# Altium schematic sheet Main.schdoc
size 304 x 211 mm
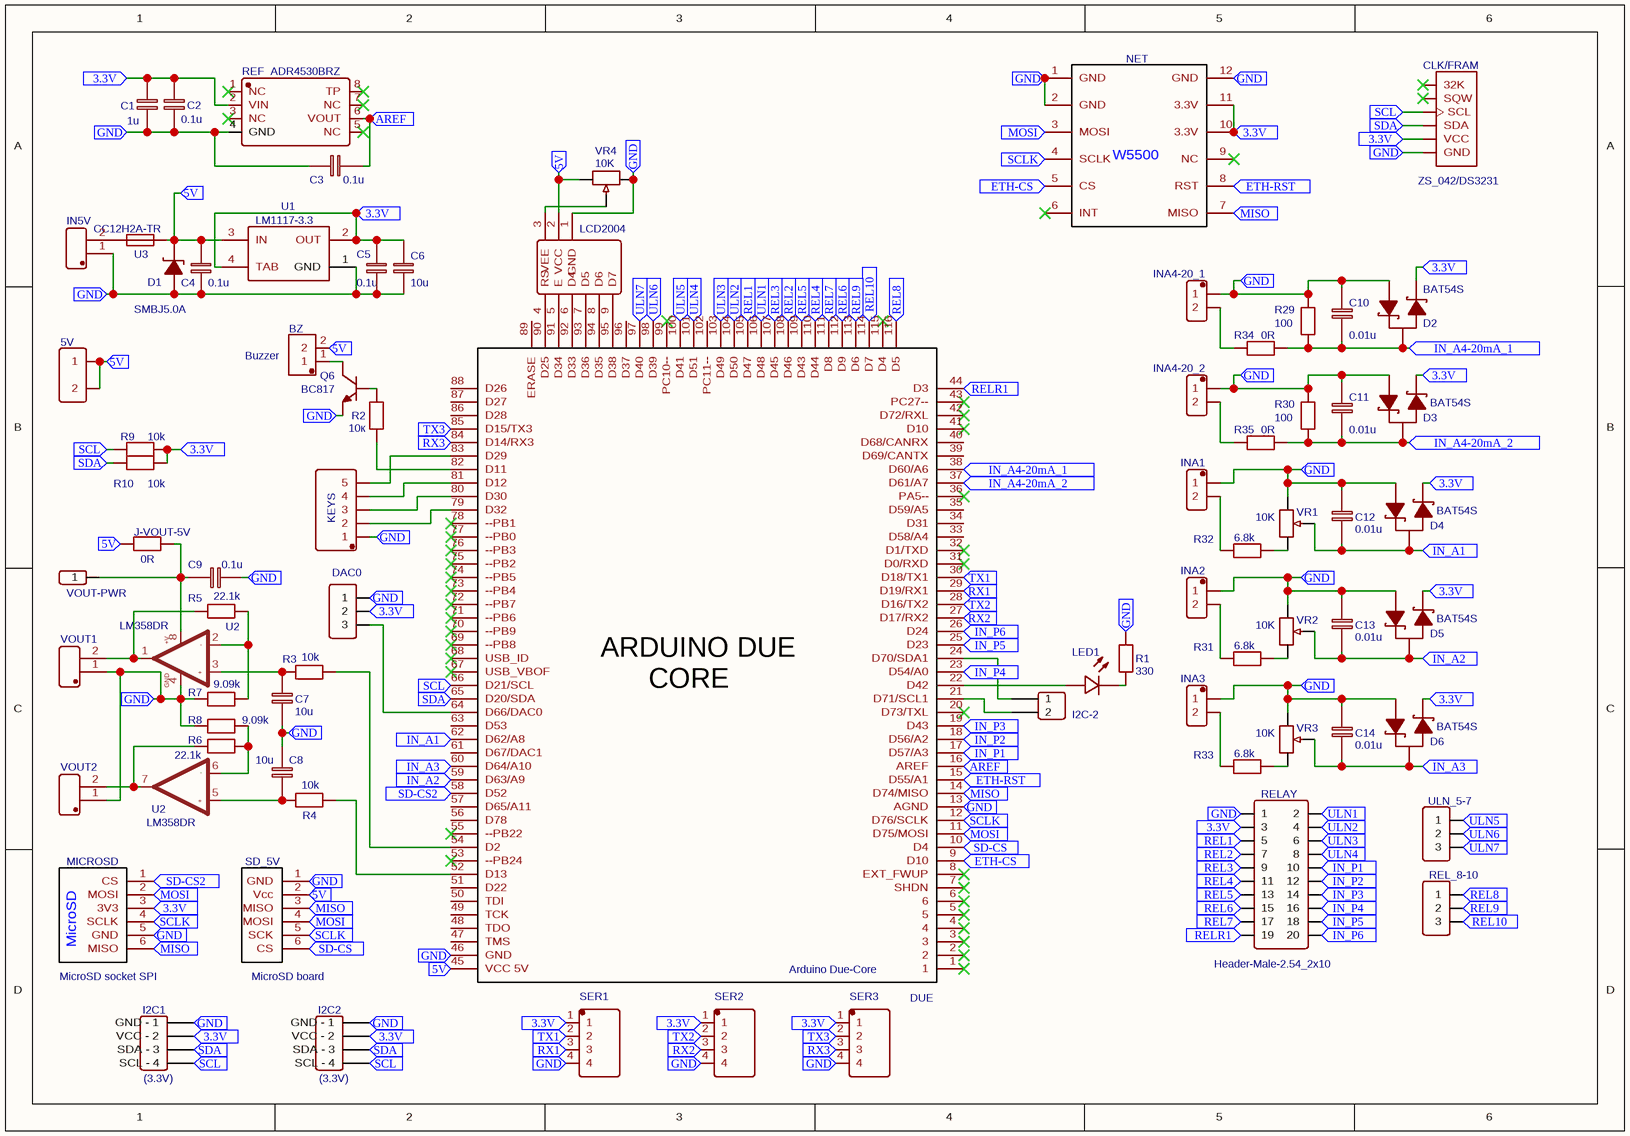
[diagram p0: Main.schdoc]

## Parts
(Parts that share a designator on the sheet are numbered #1, #2 ... from top to bottom, then left to right.)
5V  Header-Male-2.54_1x2  [HDR-2X1/2.54]  (value not drawn)
BZ  Buzzer  [KF350-3.5MM-2P]
C1  1u  [0805]
C2  0.1u  [0805]
C3  0.1u  [0805]
C4  0.1u  [0805]
C5  0.1u  [0805]
C6  10u  [0805]
C7  10u  [1206]
C8  10u  [1206]
C9  0.1u  [0805]
C10  0.01u  [0805]
C11  0.01u  [0805]
C12  0.01u  [0805]
C13  0.01u  [0805]
C14  0.01u  [0805]
CLK/FRAM  ZS_042/DS3231  [ZS-042]
D1  SMBJ5.0A  [SMB/DO-214AA]
D2  BAT54S  [SOT-23(SOT-23-3)]
D3  BAT54S  [SOT-23(SOT-23-3)]
D4  BAT54S  [SOT-23(SOT-23-3)]
D5  BAT54S  [SOT-23(SOT-23-3)]
D6  BAT54S  [SOT-23(SOT-23-3)]
DAC0  Header-Male-2.54_1x3  [HDR-3X1/2.54]  (value not drawn)
DUE  Arduino Due-Core  [ARDUINO DUE CORE]
I2C1  (3.3V)  [HDR-4X1/2.54 I2C BOARD]
I2C2  (3.3V)  [HDR-4X1/2.54 I2C BOARD]
I2C-2  2.54mm 1*2P  [HDR-2X1/2.54]  (value not drawn)
IN5V  KF128_2P_5.08  [KF128_2P_5.08]  (value not drawn)
INA1  KF301-2P  [KF128_2P_5.08]  (value not drawn)
INA2  KF301-2P  [KF128_2P_5.08]  (value not drawn)
INA3  KF301-2P  [KF128_2P_5.08]  (value not drawn)
INA4-20_1  KF301-2P  [KF128_2P_5.08]  (value not drawn)
INA4-20_2  KF301-2P  [KF128_2P_5.08]  (value not drawn)
J-VOUT-5V  0R  [0805]
KEYS  Header-Male-2.54_1x5  [DIP-1X5P-2.54MM-M]  (value not drawn)
LCD2004  LCD 1602, 2004. 4-bit mode (HD44780) pin-header  [HDR-16X1/2.54 - LCD1602, LCD2004]  (value not drawn)
LED1  LED GREEN  [LED-1206F]  (value not drawn)
MICROSD  MicroSD socket SPI  [MICROSD SOCKET]
NET  W5500 module  [W5500_MODULE]  (value not drawn)
Q6  BC817  [SOT-23(SOT-23-3)]
R1  330  [0805]
R2  10к  [0805]
R3  10k  [0805]
R4  10k  [0805]
R5  22.1k  [0805]
R6  22.1k  [0805]
R7  9.09k  [0805]
R8  9.09k  [0805]
R9  10k  [0805]
R10  10k  [0805]
R29  100  [1206]
R30  100  [1206]
R31  6.8k  [0805]
R32  6.8k  [0805]
R33  6.8k  [0805]
R34  0R  [1206]
R35  0R  [1206]
REF  ADR4530BRZ  [SOIC-8_150MIL]
REL_8-10  Header-Male-2.54_1x3  [HDR-3X1/2.54]  (value not drawn)
RELAY  Header-Male-2.54_2x10  [HDR-10X2/2.54]
SD_5V  MicroSD board  [MICROSD CARD ADAPTER]
SER1  Serail1  [DIP-1X4P-2.54MM RS485-UART]  (value not drawn)
SER2  Serail1  [DIP-1X4P-2.54MM RS485-UART]  (value not drawn)
SER3  Serail1  [DIP-1X4P-2.54MM RS485-UART]  (value not drawn)
U1  LM1117-3.3  [SOT-223]
U2#1  LM358DR  [SOIC-8_150MIL]
U2#2  LM358DR  [SOIC-8_150MIL]
U3  CC12H2A-TR  [FUSE-CC12H]
ULN_5-7  Header-Male-2.54_1x3  [HDR-3X1/2.54]  (value not drawn)
VOUT1  KF128_2P_5.08  [KF128_2P_5.08]  (value not drawn)
VOUT2  KF128_2P_5.08  [KF128_2P_5.08]  (value not drawn)
VOUT-PWR  Header-Male-2.54_1x1  [HDR-1X1/2.54]  (value not drawn)
VR1  10K  [RES-ADJ-SMD_3PIN-V-L3.1-W3.8-H1.62-PITCH1.0]
VR2  10K  [RES-ADJ-SMD_3PIN-V-L3.1-W3.8-H1.62-PITCH1.0]
VR3  10K  [RES-ADJ-SMD_3PIN-V-L3.1-W3.8-H1.62-PITCH1.0]
VR4  10K  [RES-ADJ-SMD_3PIN-V-L3.1-W3.8-H1.62-PITCH1.0]

## Ports
3.3V, 5V, AREF, ETH-CS, ETH-RST, GND, IN_A1, IN_A2, IN_A3, IN_A4-20mA_1, IN_A4-20mA_2, IN_P1, IN_P2, IN_P3, IN_P4, IN_P5, IN_P6, MISO, MOSI, REL1, REL2, REL3, REL4, REL5, REL6, REL7, REL8, REL9, REL10, RELR1, RX1, RX2, RX3, SCL, SCLK, SD-CS, SD-CS2, SDA, TX1, TX2, TX3, ULN1, ULN2, ULN3, ULN4, ULN5, ULN6, ULN7

## Nets
3.3V: C1.1 C2.1 C5.2 C6.2 CLK/FRAM.5(VCC) D2.2(K2) D3.2(K2) D4.2(K2) D5.2(K2) D6.2(K2) DAC0.2 I2C1.2(VCC_-_2) I2C2.2(VCC_-_2) MICROSD.3(3V3) NET.10(3.3V) NET.11(3.3V) R9.2 R10.2 REF.2(VIN) RELAY.3 SER1.1 SER2.1 SER3.1 U1.2(OUT) U1.4(TAB) ; port 3.3V
5V: 5V.1 5V.2 BZ.2 C4.2 D1.2(K) DUE.45(VCC_5V) J-VOUT-5V.1 LCD2004.2(VCC) SD_5V.2(Vcc) U1.3(IN) U3.2 VR4.c ; port 5V
AREF: C3.2 DUE.16(AREF) REF.6(VOUT) ; port AREF
ETH-CS: DUE.9(D10) NET.5(CS) ; port ETH-CS
ETH-RST: DUE.15(D55/A1) NET.8(RST) ; port ETH-RST
GND: C1.2 C2.2 C3.1 C4.1 C5.1 C6.1 C7.2 C8.1 C9.1 C10.1 C11.1 C12.1 C13.1 C14.1 CLK/FRAM.6(GND) D1.1(A) D2.1(A1) D3.1(A1) D4.1(A1) D5.1(A1) D6.1(A1) DAC0.1 DUE.13(AGND) DUE.46(GND) I2C1.1(GND_-_1) I2C2.1(GND_-_1) IN5V.1(PIN1) INA1.1 INA2.1 INA3.1 INA4-20_1.1 INA4-20_2.1 KEYS.1 LCD2004.1(GND) MICROSD.5(GND) NET.1(GND) NET.2(GND) NET.12(GND) Q6.2(E) R1.2 R7.1 R8.1 R29.1 R30.1 REF.4(GND) RELAY.1 SD_5V.1(GND) SER1.4 SER2.4 SER3.4 U1.1(GND) U2#1.4(GND) VOUT1.1(PIN1) VOUT2.1(PIN1) VR1.a VR2.a VR3.a VR4.a ; port GND
IN_A1: C12.2 D4.3(A) DUE.62(D62/A8) VR1.b ; port IN_A1
IN_A2: C13.2 D5.3(A) DUE.59(D63/A9) VR2.b ; port IN_A2
IN_A3: C14.2 D6.3(A) DUE.60(D64/A10) VR3.b ; port IN_A3
IN_A4-20mA_1: C10.2 D2.3(A) DUE.38(D60/A6) R29.2 R34.2 ; port IN_A4-20mA_1
IN_A4-20mA_2: C11.2 D3.3(A) DUE.37(D61/A7) R30.2 R35.2 ; port IN_A4-20mA_2
IN_P1: DUE.17(D57/A3) RELAY.10 ; port IN_P1
IN_P2: DUE.18(D56/A2) RELAY.12 ; port IN_P2
IN_P3: DUE.19(D43) RELAY.14 ; port IN_P3
IN_P4: DUE.23(D54/A0) RELAY.16 ; port IN_P4
IN_P5: DUE.25(D23) RELAY.18 ; port IN_P5
IN_P6: DUE.26(D24) RELAY.20 ; port IN_P6
MISO: DUE.14(D74/MISO) MICROSD.6(MISO) NET.7(MISO) SD_5V.3(MISO) ; port MISO
MOSI: DUE.11(D75/MOSI) MICROSD.2(MOSI) NET.3(MOSI) SD_5V.4(MOSI) ; port MOSI
REL1: DUE.105(D47) RELAY.5 ; port REL1
REL2: DUE.108(D46) RELAY.7 ; port REL2
REL3: DUE.107(D45) RELAY.9 ; port REL3
REL4: DUE.110(D44) RELAY.11 ; port REL4
REL5: DUE.109(D43) RELAY.13 ; port REL5
REL6: DUE.112(D9) RELAY.15 ; port REL6
REL7: DUE.111(D8) RELAY.17 ; port REL7
REL8: DUE.116(D5) REL_8-10.1 ; port REL8
REL9: DUE.113(D6) REL_8-10.2 ; port REL9
REL10: DUE.114(D7) REL_8-10.3 ; port REL10
RELR1: DUE.44(D3) RELAY.19 ; port RELR1
RX1: DUE.29(D19/RX1) SER1.3 ; port RX1
RX2: DUE.27(D17/RX2) SER2.3 ; port RX2
RX3: DUE.84(D14/RX3) SER3.3 ; port RX3
SCL: CLK/FRAM.3(SCL) DUE.66(D21/SCL) I2C1.4(SCL_-_4) I2C2.4(SCL_-_4) R9.1 ; port SCL
SCLK: DUE.12(D76/SCLK) MICROSD.4(SCLK) NET.4(SCLK) SD_5V.5(SCK) ; port SCLK
SD-CS: DUE.10(D4) SD_5V.6(CS) ; port SD-CS
SD-CS2: DUE.58(D52) MICROSD.1(CS) ; port SD-CS2
SDA: CLK/FRAM.4(SDA) DUE.65(D20/SDA) I2C1.3(SDA_-_3) I2C2.3(SDA_-_3) R10.1 ; port SDA
TX1: DUE.30(D18/TX1) SER1.2 ; port TX1
TX2: DUE.28(D16/TX2) SER2.2 ; port TX2
TX3: DUE.85(D15/TX3) SER3.2 ; port TX3
ULN1: DUE.106(D48) RELAY.2 ; port ULN1
ULN2: DUE.104(D50) RELAY.4 ; port ULN2
ULN3: DUE.103(D49) RELAY.6 ; port ULN3
ULN4: DUE.101(D51) RELAY.8 ; port ULN4
ULN5: DUE.100(D41) ULN_5-7.1 ; port ULN5
ULN6: DUE.98(D39) ULN_5-7.2 ; port ULN6
ULN7: DUE.97(D40) ULN_5-7.3 ; port ULN7
NetBZ_1: BZ.1 Q6.3(C)
NetC7_1: C7.1 R3.1 U2#1.3(+IN1)
NetC8_2: C8.2 R4.1 U2#2.5(+IN2)
NetC9_2: C9.2 J-VOUT-5V.2 U2#1.8(+V) VOUT-PWR.1
NetDAC0_3: DAC0.3 DUE.64(D66/DAC0)
NetDUE_21: DUE.21(D71/SCL1) I2C-2.2
NetDUE_22: DUE.22(D42) LED1.1(+)
NetDUE_24: DUE.24(D70/SDA1) I2C-2.1
NetDUE_52: DUE.52(D13) R4.2
NetDUE_54: DUE.54(D2) R3.2
NetDUE_79: DUE.79(D32) KEYS.2
NetDUE_80: DUE.80(D30) KEYS.3
NetDUE_81: DUE.81(D12) KEYS.4
NetDUE_82: DUE.82(D11) R2.1
NetDUE_83: DUE.83(D29) KEYS.5
NetDUE_90: DUE.90(D25) LCD2004.4(RS)
NetDUE_91: DUE.91(D34) LCD2004.5(E)
NetDUE_92: DUE.92(D33) LCD2004.6(D4)
NetDUE_93: DUE.93(D36) LCD2004.7(D5)
NetDUE_94: DUE.94(D35) LCD2004.8(D6)
NetDUE_95: DUE.95(D38) LCD2004.9(D7)
NetIN5V_2: IN5V.2(PIN2) U3.1
NetINA1_2: INA1.2 R32.1
NetINA2_2: INA2.2 R31.1
NetINA3_2: INA3.2 R33.1
NetINA4-20_1_2: INA4-20_1.2 R34.1
NetINA4-20_2_2: INA4-20_2.2 R35.1
NetLCD2004_3: LCD2004.3(VEE) VR4.b
NetLED1_2: LED1.2(-) R1.1
NetQ6_1: Q6.1(B) R2.2
NetR5_1: R5.1 U2#1.1(OUT1) VOUT1.2(PIN2)
NetR5_2: R5.2 R7.2 U2#1.2(-IN1)
NetR6_1: R6.1 U2#2.7(OUT2) VOUT2.2(PIN2)
NetR6_2: R6.2 R8.2 U2#2.6(-IN2)
NetR31_2: R31.2 VR2.c
NetR32_2: R32.2 VR1.c
NetR33_2: R33.2 VR3.c

Not connected (* = marked no-connect by the designer): CLK/FRAM 1(32K)* 2(SQW)*; DUE 1* 2* 3* 4* 5* 6* 7(SHDN)* 8(EXT_FWUP)* 20(D73/TXL)* 31(D0/RXD)* 32(D1/TXD)* 33(D58/A4) 34(D31) 35(D59/A5) 36(PA5--)* 39(D69/CANTX) 40(D68/CANRX) 41(D10)* 42(D72/RXL)* 43(PC27--)* 47(TMS) 48(TDO) 49(TCK) 50(TDI) 51(D22) 53(--PB24)* 55(--PB22)* 56(D78) 57(D65/A11) 61(D67/DAC1) 63(D53) 67(USB_VBOF)* 68(USB_ID)* 69(--PB8)* 70(--PB9)* 71(--PB6)* 72(--PB7)* 73(--PB4)* 74(--PB5)* 75(--PB2)* 76(--PB3)* 77(--PB0)* 78(--PB1)* 86(D28) 87(D27) 88(D26) 89(ERASE) 96(D37) 99(PC10--)* 102(PC11--) 115(D4)*; NET 6(INT)* 9(NC)*; REF 1(NC)* 3(NC)* 5(NC)* 7(NC)* 8(TP)*

## Notes on the sheet
- (in symbol Arduino Due-Core) ARDUINO DUE / CORE
- (in symbol LM358DR) -; +
- (in symbol MicroSD socket SPI) MicroSD
- (in symbol W5500 module) W5500

## Library data of the parts
5V = Header-Male-2.54_1x2: BOM_Manufacturer: TE Connectivity; BOM_Manufacturer Part: 826629-2; BOM_Supplier: LCSC; image: //image.lceda.cn/szlcsc/C86471.jpg; BOM_Supplier Part: C86471; spicePre: H
BZ = Buzzer: BOM_Manufacturer: ReliaPro; BOM_Manufacturer Part: WJ2EDGVC-5.08-2P; spicePre: X; BOM_Supplier Part: C8445; BOM_Supplier: LCSC
C1 = 1u: nameAlias: Value(F); BOM_Manufacturer Part: ?; spicePre: C; spiceSymbolName: Cap_RAD-0.1_EU
C2-C5 C9 = 0.1u: nameAlias: Value(F); BOM_Manufacturer Part: ?; spicePre: C
  C2-C5: spiceSymbolName: Cap_RAD-0.1_EU
  C9: spiceSymbolName: Cap_0805_EU
C6-C8 = 10u: nameAlias: Value(F); BOM_Manufacturer Part: ?; spicePre: C
  C6: spiceSymbolName: Cap_RAD-0.1_EU
  C7 C8: spiceSymbolName: Cap_0603_EU
C10-C14 = 0.01u: nameAlias: Value(F); BOM_Manufacturer Part: ?; spicePre: C; spiceSymbolName: Cap_0805_EU
CLK/FRAM = ZS_042/DS3231: BOM_Manufacturer Part: DS3231; Contributor: popov_a_r; spicePre: C
D1 = SMBJ5.0A: BOM_Manufacturer: Brightking; SMT Type: Extend; BOM_Supplier: LCSC; BOM_Manufacturer Part: SMBJ5.0A; image: //image.lceda.cn/szlcsc/C78423.jpg; BOM_Supplier Part: C78423; BOM_LCSC Assembly: Yes; spicePre: D
D2-D6 = BAT54S: BOM_Manufacturer: SEMTECH; SMT Type: Extend; BOM_Supplier: LCSC; BOM_Manufacturer Part: BAT54S; image: //image.lceda.cn/szlcsc/C83935.jpg; BOM_Supplier Part: C83935; BOM_LCSC Assembly: Yes; spicePre: D
DAC0 REL_8-10 ULN_5-7 = Header-Male-2.54_1x3: BOM_Manufacturer: BOOMELE; BOM_Manufacturer Part: Header2.54mm 1*3P; BOM_Supplier: LCSC; image: //image.lceda.cn/szlcsc/C49257.jpg; BOM_Supplier Part: C49257; spicePre: P
DUE = Arduino Due-Core: Contributor: vad7; BOM_Manufacturer Part: ?; BOM_Supplier Part: undefined; spicePre: U
I2C1 I2C2 = (3.3V): BOM_Manufacturer: ReliaPro; BOM_Manufacturer Part: Headers??Pins 1*4P; BOM_Supplier: LCSC; image: http://image.lceda.cn/szlcsc/C59481.jpg; spicePre: P
I2C-2 = 2.54mm 1*2P: BOM_Manufacturer: ReliaPro; BOM_Supplier: LCSC; BOM_Manufacturer Part: 2.54mm 1*2P; image: http://image.lceda.cn/szlcsc/C36717.jpg; BOM_Supplier Part: C36717; spicePre: P
IN5V VOUT1 VOUT2 = KF128_2P_5.08: BOM_Manufacturer: Kefa Electronics; BOM_Manufacturer Part: KF128L-5.08; Contributor: GrahamG; spicePre: J
INA1-INA3 INA4-20_1 INA4-20_2 = KF301-2P: Contributor: Sulfurex; spicePre: X; BOM_Supplier Part: C8445; BOM_Supplier: LCSC; BOM_Manufacturer Part: ?
J-VOUT-5V R34 R35 = 0R: nameAlias: Value(Ω); BOM_Manufacturer Part: ?; spicePre: R; spiceSymbolName: Res_0805(1/8W)_EU
KEYS = Header-Male-2.54_1x5: BOM_Manufacturer: Ckmtw; BOM_Manufacturer Part: 210S-1*5P L=11.6MMGold-plated black; Contributor: LCSC; BOM_Supplier: LCSC; BOM_Supplier Part: C124379; spicePre: H
LCD2004 = LCD 1602, 2004. 4-bit mode (HD44780) pin-header: BOM_Manufacturer Part: 16x2 LCD (HD44780); Contributor: Mjtt0514; spicePre: L
LED1 = LED GREEN: BOM_Manufacturer: Everlight Elec; BOM_Manufacturer Part: 15-21/RSC-BS1T2B/2T; Contributor: LCSC; BOM_Supplier: LCSC; BOM_Supplier Part: C264385; spicePre: L
MICROSD = MicroSD socket SPI: nameAlias: Model; catid: 20; Contributor: mid150; spicePre: X; BOM_Manufacturer Part: ?; spiceSymbolName: MicroSD socket SPI
NET = W5500 module: Contributor: RubenDijk; BOM_Manufacturer Part: ?; spicePre: U
Q6 = BC817: BOM_Manufacturer: CJ; SMT Type: Extend; BOM_Supplier: LCSC; BOM_Manufacturer Part: BC817; image: //image.lceda.cn/szlcsc/C8589.jpg; BOM_Supplier Part: C8589; BOM_LCSC Assembly: Yes; spicePre: Q
R1 = 330: nameAlias: Value(Ω); BOM_Manufacturer Part: ?; spicePre: R; spiceSymbolName: Res_0805(1/8W)_EU
R2 = 10к: nameAlias: Value(Ω); BOM_Manufacturer Part: ?; spicePre: R; spiceSymbolName: Res_0805(1/8W)_EU
R3 R4 R9 R10 = 10k: nameAlias: Value(Ω); BOM_Manufacturer Part: ?; spicePre: R; spiceSymbolName: Res_0805(1/8W)_EU
R5 R6 = 22.1k: nameAlias: Value(Ω); BOM_Manufacturer Part: ?; spicePre: R; spiceSymbolName: Res_0805(1/8W)_EU
R7 R8 = 9.09k: nameAlias: Value(Ω); BOM_Manufacturer Part: ?; spicePre: R; spiceSymbolName: Res_0805(1/8W)_EU
R29 R30 = 100: nameAlias: Value(Ω); BOM_Manufacturer Part: ?; spicePre: R; spiceSymbolName: Res_0805(1/8W)_EU
R31-R33 = 6.8k: nameAlias: Value(Ω); BOM_Manufacturer Part: ?; spicePre: R; spiceSymbolName: Res_0805(1/8W)_EU
REF = ADR4530BRZ: BOM_Manufacturer: Analog Devices; Contributor: LCSC; BOM_Supplier: LCSC; BOM_Supplier Part: C208042; BOM_Manufacturer Part: ADR4530BRZ; spicePre: U
SD_5V = MicroSD board: Contributor: hernanmario31; BOM_Manufacturer Part: ?; BOM_Supplier: Hernan; spicePre: U
SER1-SER3 = Serail1: BOM_Manufacturer: Ckmtw; BOM_Manufacturer Part: 210S-1*4P L=11.6MMGold-plated black; Contributor: LCSC; BOM_Supplier: LCSC; BOM_Supplier Part: C124378; spicePre: H
U1 = LM1117-3.3: BOM_Manufacturer: TI; BOM_Manufacturer Part: LM1117IMPX-3.3/NOPB; SMT Type: Extend; BOM_Supplier: LCSC; image: //image.lceda.cn/szlcsc/C23984.jpg; BOM_Supplier Part: C23984; BOM_LCSC Assembly: Yes; spicePre: U
U2#1 U2#2 = LM358DR: BOM_Manufacturer: TI; subpart_no: 1; tags: General Operational Amplifier; sourceId: rjTtr0Aa8; BOM_SeeedStudio: 310020021; Package Display: No; timeStamp: 1448067227; BOM_Supplier Part: C5423; BOM_Supplier: LCSC; BOM_Manufacturer Part: LM358DR; image: http://image.lceda.cn/szlcsc/C5423.jpg; spicePre: U
U3 = CC12H2A-TR: BOM_Manufacturer: BUSSMANN; Contributor: LCSC; BOM_Supplier: LCSC; BOM_Supplier Part: C340908; BOM_Manufacturer Part: CC12H2A-TR; spicePre: U
VOUT-PWR = Header-Male-2.54_1x1: BOM_Manufacturer: ReliaPro; BOM_Supplier: LCSC; BOM_Manufacturer Part: Header-Male-2.54_1x1; BOM_Supplier Part: C81276; spicePre: P
VR1-VR4 = 10K: BOM_Manufacturer: PANASONIC; BOM_Manufacturer Part: EVM3ESX50B14; nameAlias: Resistance(Ohms); BOM_Supplier: LCSC; BOM_Supplier Part: C11959; spicePre: V; spiceSymbolName: EVM3ESX50B33
RELAY = Header-Male-2.54_2x10: BOM_Supplier: LCSC; image: http://image.lceda.cn/szlcsc/C62032.jpg; BOM_Supplier Part: C62032; BOM_Manufacturer Part: ?; spicePre: P